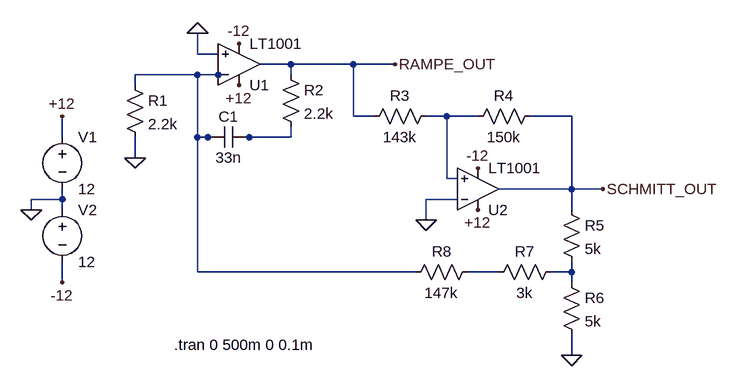
[diagram p0: schematic rampen-generator.asc]
rampen-generator.asc, the LTspice schematic file:
Version 4
SHEET 1 1108 680
WIRE 272 48 272 16
WIRE 304 48 272 48
WIRE 416 64 368 64
WIRE 512 64 416 64
WIRE 576 64 512 64
WIRE 272 80 176 80
WIRE 304 80 272 80
WIRE 320 80 304 80
WIRE 416 80 416 64
WIRE 176 96 176 80
WIRE 512 144 512 64
WIRE 544 144 512 144
WIRE 656 144 624 144
WIRE 704 144 656 144
WIRE 848 144 784 144
WIRE 64 176 64 144
WIRE 272 176 272 80
WIRE 288 176 272 176
WIRE 304 176 288 176
WIRE 352 176 336 176
WIRE 416 176 416 160
WIRE 416 176 352 176
WIRE 176 208 176 176
WIRE 656 240 656 144
WIRE 672 240 656 240
WIRE 848 256 848 144
WIRE 848 256 736 256
WIRE 896 256 848 256
WIRE 64 272 64 256
WIRE 64 272 16 272
WIRE 672 272 624 272
WIRE 16 288 16 272
WIRE 64 288 64 272
WIRE 848 288 848 256
WIRE 624 304 624 272
WIRE 272 384 272 176
WIRE 608 384 272 384
WIRE 736 384 688 384
WIRE 848 384 848 368
WIRE 848 384 816 384
WIRE 64 400 64 368
WIRE 848 400 848 384
WIRE 848 512 848 480
FLAG 16 288 0
FLAG 64 144 +12
FLAG 64 400 -12
FLAG 272 16 0
FLAG 176 208 0
FLAG 624 304 0
FLAG 848 512 0
FLAG 336 96 +12
FLAG 704 288 +12
FLAG 336 32 -12
FLAG 704 224 -12
FLAG 576 64 RAMPE_OUT
FLAG 896 256 SCHMITT_OUT
SYMBOL voltage 64 160 R0
WINDOW 123 0 0 Left 0
WINDOW 39 0 0 Left 0
SYMATTR InstName V1
SYMATTR Value 12
SYMBOL voltage 64 272 R0
WINDOW 123 0 0 Left 0
WINDOW 39 0 0 Left 0
SYMATTR InstName V2
SYMATTR Value 12
SYMBOL Opamps\\LT1001 336 128 M180
SYMATTR InstName U1
SYMBOL res 160 80 R0
SYMATTR InstName R1
SYMATTR Value 2.2k
SYMBOL cap 352 160 R90
WINDOW 0 0 32 VBottom 0
WINDOW 3 32 32 VTop 0
SYMATTR InstName C1
SYMATTR Value 33n
SYMBOL res 400 64 R0
SYMATTR InstName R2
SYMATTR Value 2.2k
SYMBOL res 640 128 R90
WINDOW 0 0 56 VBottom 0
WINDOW 3 32 56 VTop 0
SYMATTR InstName R3
SYMATTR Value 143k
SYMBOL res 800 128 R90
WINDOW 0 0 56 VBottom 0
WINDOW 3 32 56 VTop 0
SYMATTR InstName R4
SYMATTR Value 150k
SYMBOL Opamps\\LT1001 704 320 M180
SYMATTR InstName U2
SYMBOL res 832 272 R0
SYMATTR InstName R5
SYMATTR Value 5k
SYMBOL res 832 384 R0
SYMATTR InstName R6
SYMATTR Value 5k
SYMBOL res 832 368 R90
WINDOW 0 0 56 VBottom 0
WINDOW 3 32 56 VTop 0
SYMATTR InstName R7
SYMATTR Value 3k
SYMBOL res 704 368 R90
WINDOW 0 0 56 VBottom 0
WINDOW 3 32 56 VTop 0
SYMATTR InstName R8
SYMATTR Value 147k
TEXT 236 496 Left 0 !.tran 0 500m 0 0.1m

The netlist it stands for:
* rampen-generator.asc
V1 +12 0 12
V2 0 -12 12
XU1 0 N001 +12 -12 RAMPE_OUT LT1001  ; pins In+ In- V+ V- OUT
R1 N001 0 2.2k
C1 N003 N001 33n
R2 RAMPE_OUT N003 2.2k
R3 N002 RAMPE_OUT 143k
R4 SCHMITT_OUT N002 150k
XU2 N002 0 +12 -12 SCHMITT_OUT LT1001  ; pins In+ In- V+ V- OUT
R5 SCHMITT_OUT N005 5k
R6 N005 0 5k
R7 N005 N004 3k
R8 N004 N001 147k
.tran 0 500m 0 0.1m
.lib LTC.lib
.backanno
.end